# EAGLE schematic IOexpander_2X12_latch  (EAGLE 9.6.2)
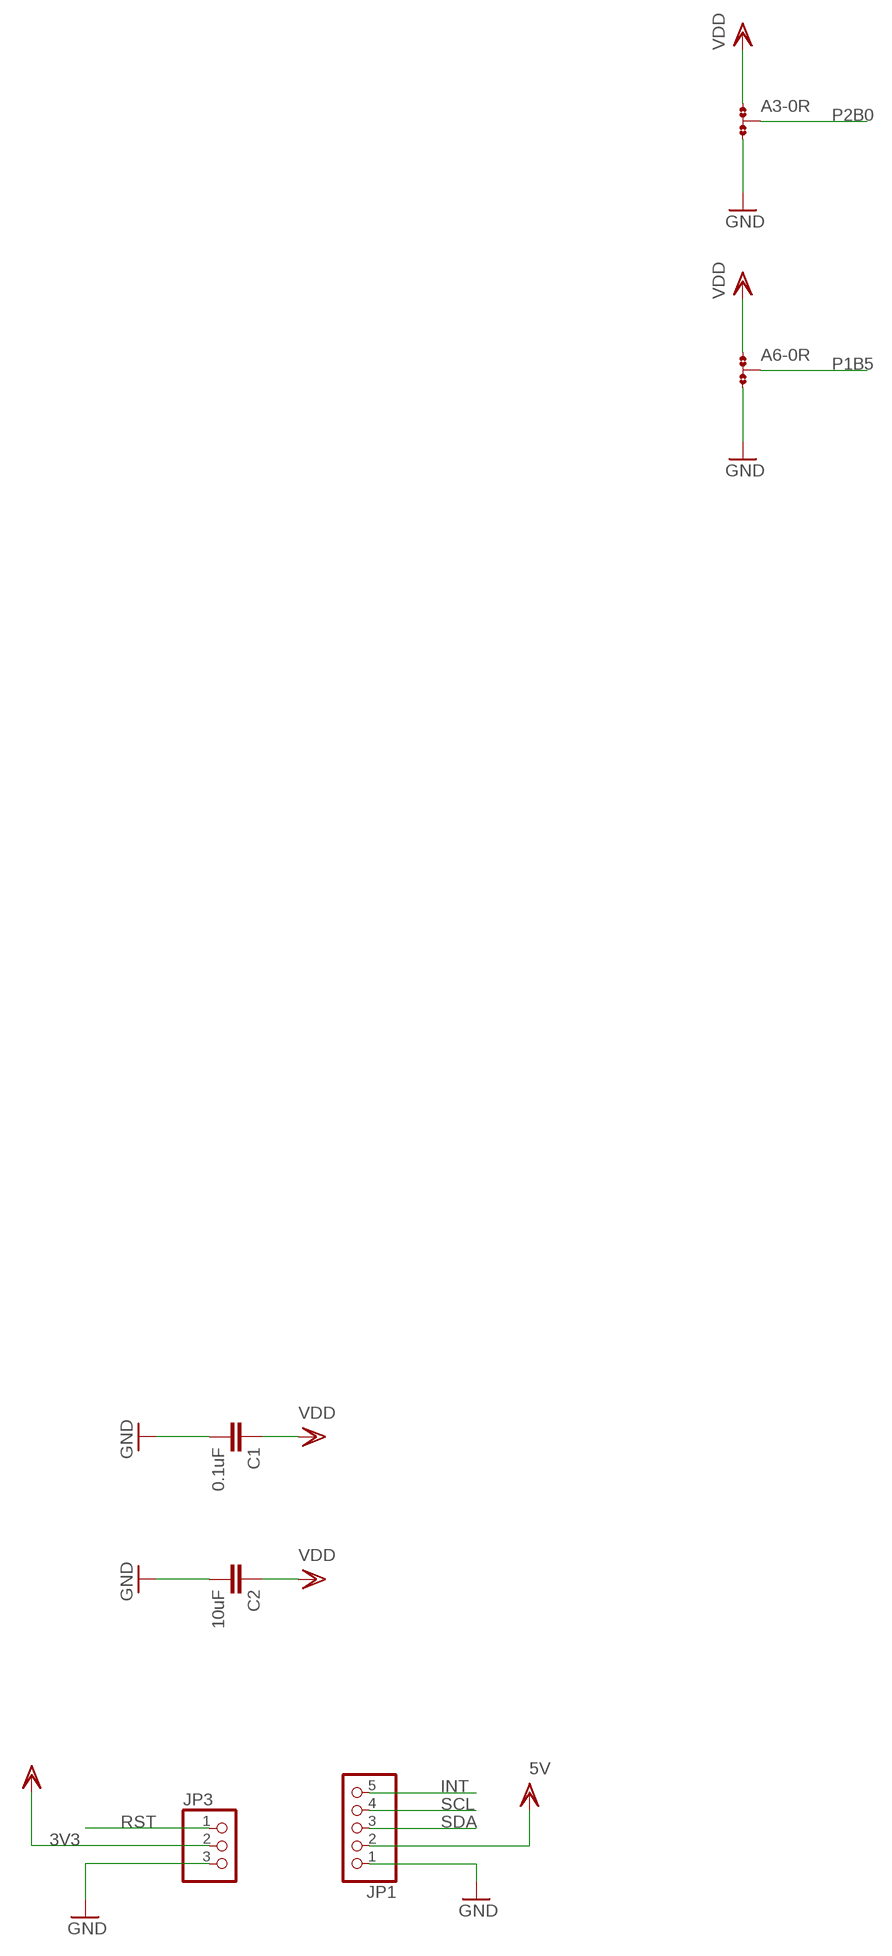
[diagram p0: schematic, sheet 1, part 1 of 2]
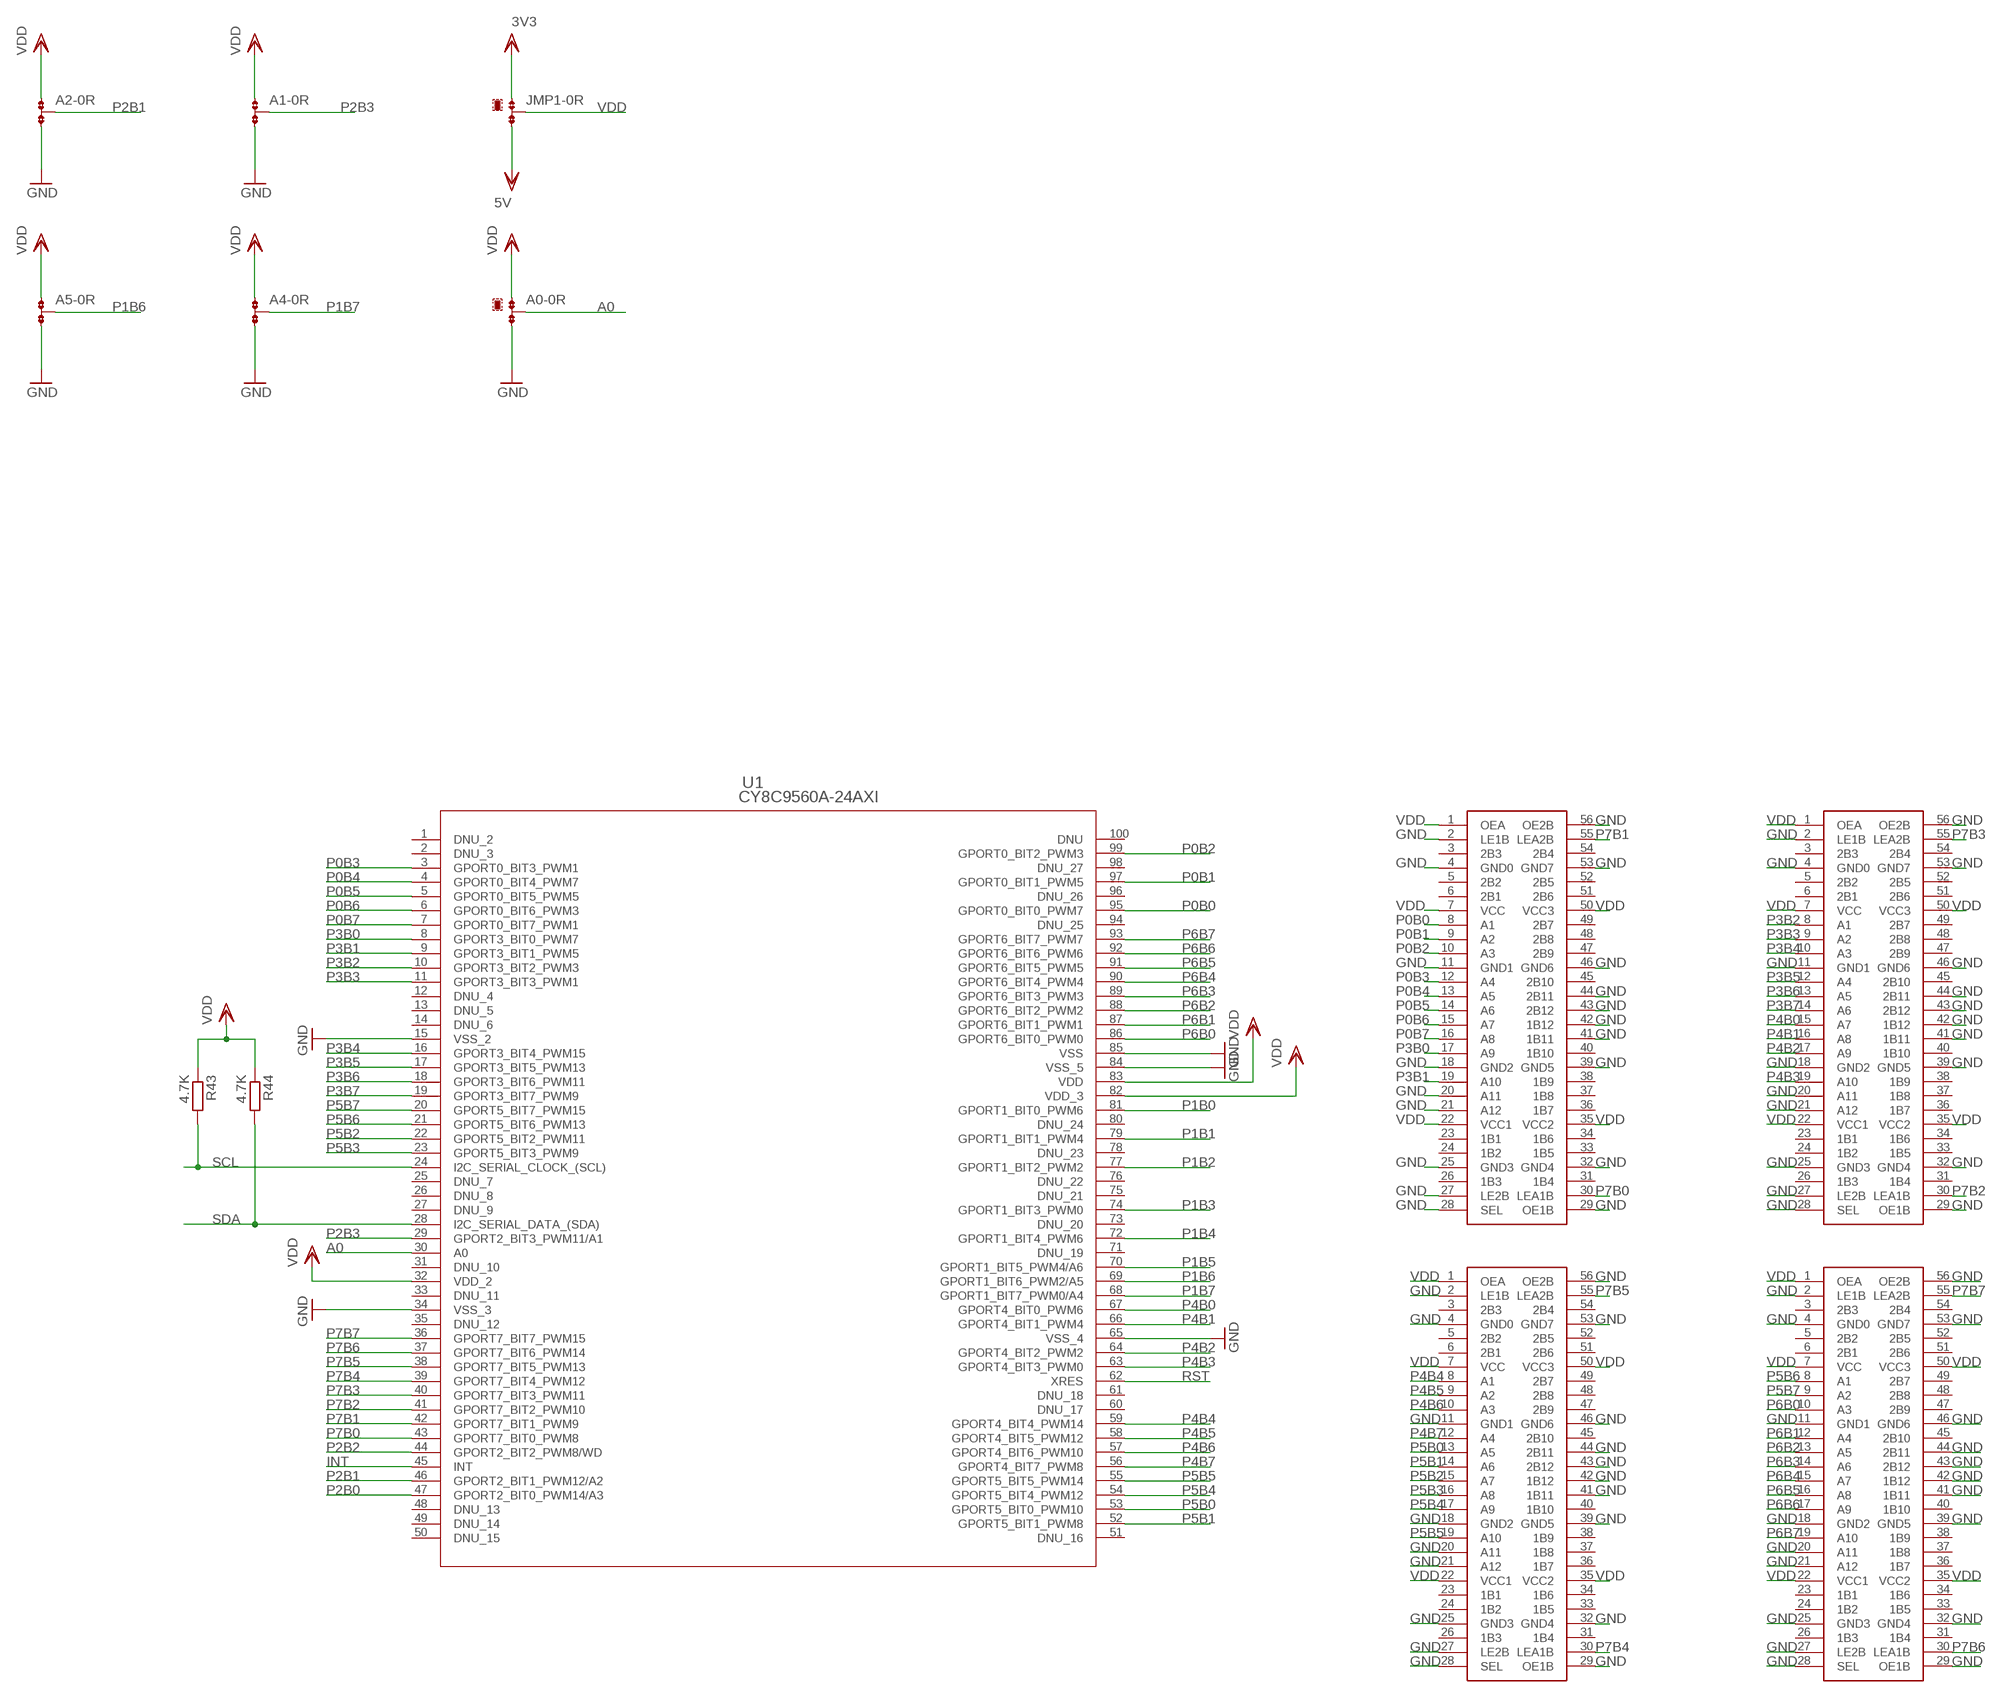
[diagram p1: schematic, sheet 1, part 2 of 2]

## Parts
A0  0R-JUMPA  [A0R-JMP]
A1  0R-JUMPA  [A0R-JMP]
A2  0R-JUMPA  [A0R-JMP]
A3  0R-JUMPA  [A0R-JMP]
A4  0R-JUMPA  [A0R-JMP]
A5  0R-JUMPA  [A0R-JMP]
A6  0R-JUMPA  [A0R-JMP]
C1  0.1uF  C-EUC0805  [C0805]
C2  10uF  C-EUC0805  [C0805]
JMP1  0R-JUMPA  [A0R-JMP]
JP1  PINHD-1X5  [1X05]
JP3  PINHD-1X3  [1X03]
R43  4.7K  R-EU_R0805  [R0805]
R44  4.7K  R-EU_R0805  [R0805]
U1  CY8C9560A-24AXI  [TQFP-100]
U$1  SN74ALVCH162260DLR  [SN74ALVCH162260DLR]
U$2  SN74ALVCH162260DLR  [SN74ALVCH162260DLR]
U$3  SN74ALVCH162260DLR  [SN74ALVCH162260DLR]
U$4  SN74ALVCH162260DLR  [SN74ALVCH162260DLR]

## Nets
3V3: JMP1.1 JP3.2 ; supply symbol labelled VDD
5V: JMP1.3 JP1.2 ; supply symbol labelled VDD
A0: A0.2 U1.30(A0)
GND: A0.3 A1.3 A2.3 A3.3 A4.3 A5.3 A6.3 C1.2 C2.2 JP1.1 JP3.3 U1.15(VSS_2) U1.34(VSS_3) U1.65(VSS_4) U1.84(VSS_5) U1.85(VSS) U$1.2(LE1B) U$1.4(GND0) U$1.11(GND1) U$1.18(GND2) U$1.20(A11) U$1.21(A12) U$1.25(GND3) U$1.27(LE2B) U$1.28(SEL) U$1.29(OE1B) U$1.32(GND4) U$1.39(GND5) U$1.41(1B11) U$1.42(1B12) U$1.43(2B12) U$1.44(2B11) U$1.46(GND6) U$1.53(GND7) U$1.56(OE2B) U$2.2(LE1B) U$2.4(GND0) U$2.11(GND1) U$2.18(GND2) U$2.20(A11) U$2.21(A12) U$2.25(GND3) U$2.27(LE2B) U$2.28(SEL) U$2.29(OE1B) U$2.32(GND4) U$2.39(GND5) U$2.41(1B11) U$2.42(1B12) U$2.43(2B12) U$2.44(2B11) U$2.46(GND6) U$2.53(GND7) U$2.56(OE2B) U$3.2(LE1B) U$3.4(GND0) U$3.11(GND1) U$3.18(GND2) U$3.20(A11) U$3.21(A12) U$3.25(GND3) U$3.27(LE2B) U$3.28(SEL) U$3.29(OE1B) U$3.32(GND4) U$3.39(GND5) U$3.41(1B11) U$3.42(1B12) U$3.43(2B12) U$3.44(2B11) U$3.46(GND6) U$3.53(GND7) U$3.56(OE2B) U$4.2(LE1B) U$4.4(GND0) U$4.11(GND1) U$4.18(GND2) U$4.20(A11) U$4.21(A12) U$4.25(GND3) U$4.27(LE2B) U$4.28(SEL) U$4.29(OE1B) U$4.32(GND4) U$4.39(GND5) U$4.41(1B11) U$4.42(1B12) U$4.43(2B12) U$4.44(2B11) U$4.46(GND6) U$4.53(GND7) U$4.56(OE2B)
INT: JP1.5 U1.45(INT)
P0B0: U1.95(GPORT0_BIT0_PWM7) U$1.8(A1)
P0B1: U1.97(GPORT0_BIT1_PWM5) U$1.9(A2)
P0B2: U1.99(GPORT0_BIT2_PWM3) U$1.10(A3)
P0B3: U1.3(GPORT0_BIT3_PWM1) U$1.12(A4)
P0B4: U1.4(GPORT0_BIT4_PWM7) U$1.13(A5)
P0B5: U1.5(GPORT0_BIT5_PWM5) U$1.14(A6)
P0B6: U1.6(GPORT0_BIT6_PWM3) U$1.15(A7)
P0B7: U1.7(GPORT0_BIT7_PWM1) U$1.16(A8)
P1B0: U1.81(GPORT1_BIT0_PWM6)
P1B1: U1.79(GPORT1_BIT1_PWM4)
P1B2: U1.77(GPORT1_BIT2_PWM2)
P1B3: U1.74(GPORT1_BIT3_PWM0)
P1B4: U1.72(GPORT1_BIT4_PWM6)
P1B5: A6.2 U1.70(GPORT1_BIT5_PWM4/A6)
P1B6: A5.2 U1.69(GPORT1_BIT6_PWM2/A5)
P1B7: A4.2 U1.68(GPORT1_BIT7_PWM0/A4)
P2B0: A3.2 U1.47(GPORT2_BIT0_PWM14/A3)
P2B1: A2.2 U1.46(GPORT2_BIT1_PWM12/A2)
P2B2: U1.44(GPORT2_BIT2_PWM8/WD)
P2B3: A1.2 U1.29(GPORT2_BIT3_PWM11/A1)
P3B0: U1.8(GPORT3_BIT0_PWM7) U$1.17(A9)
P3B1: U1.9(GPORT3_BIT1_PWM5) U$1.19(A10)
P3B2: U1.10(GPORT3_BIT2_PWM3) U$3.8(A1)
P3B3: U1.11(GPORT3_BIT3_PWM1) U$3.9(A2)
P3B4: U1.16(GPORT3_BIT4_PWM15) U$3.10(A3)
P3B5: U1.17(GPORT3_BIT5_PWM13) U$3.12(A4)
P3B6: U1.18(GPORT3_BIT6_PWM11) U$3.13(A5)
P3B7: U1.19(GPORT3_BIT7_PWM9) U$3.14(A6)
P4B0: U1.67(GPORT4_BIT0_PWM6) U$3.15(A7)
P4B1: U1.66(GPORT4_BIT1_PWM4) U$3.16(A8)
P4B2: U1.64(GPORT4_BIT2_PWM2) U$3.17(A9)
P4B3: U1.63(GPORT4_BIT3_PWM0) U$3.19(A10)
P4B4: U1.59(GPORT4_BIT4_PWM14) U$2.8(A1)
P4B5: U1.58(GPORT4_BIT5_PWM12) U$2.9(A2)
P4B6: U1.57(GPORT4_BIT6_PWM10) U$2.10(A3)
P4B7: U1.56(GPORT4_BIT7_PWM8) U$2.12(A4)
P5B0: U1.53(GPORT5_BIT0_PWM10) U$2.13(A5)
P5B1: U1.52(GPORT5_BIT1_PWM8) U$2.14(A6)
P5B2: U1.22(GPORT5_BIT2_PWM11) U$2.15(A7)
P5B3: U1.23(GPORT5_BIT3_PWM9) U$2.16(A8)
P5B4: U1.54(GPORT5_BIT4_PWM12) U$2.17(A9)
P5B5: U1.55(GPORT5_BIT5_PWM14) U$2.19(A10)
P5B6: U1.21(GPORT5_BIT6_PWM13) U$4.8(A1)
P5B7: U1.20(GPORT5_BIT7_PWM15) U$4.9(A2)
P6B0: U1.86(GPORT6_BIT0_PWM0) U$4.10(A3)
P6B1: U1.87(GPORT6_BIT1_PWM1) U$4.12(A4)
P6B2: U1.88(GPORT6_BIT2_PWM2) U$4.13(A5)
P6B3: U1.89(GPORT6_BIT3_PWM3) U$4.14(A6)
P6B4: U1.90(GPORT6_BIT4_PWM4) U$4.15(A7)
P6B5: U1.91(GPORT6_BIT5_PWM5) U$4.16(A8)
P6B6: U1.92(GPORT6_BIT6_PWM6) U$4.17(A9)
P6B7: U1.93(GPORT6_BIT7_PWM7) U$4.19(A10)
P7B0: U1.43(GPORT7_BIT0_PWM8) U$1.30(LEA1B)
P7B1: U1.42(GPORT7_BIT1_PWM9) U$1.55(LEA2B)
P7B2: U1.41(GPORT7_BIT2_PWM10) U$3.30(LEA1B)
P7B3: U1.40(GPORT7_BIT3_PWM11) U$3.55(LEA2B)
P7B4: U1.39(GPORT7_BIT4_PWM12) U$2.30(LEA1B)
P7B5: U1.38(GPORT7_BIT5_PWM13) U$2.55(LEA2B)
P7B6: U1.37(GPORT7_BIT6_PWM14) U$4.30(LEA1B)
P7B7: U1.36(GPORT7_BIT7_PWM15) U$4.55(LEA2B)
RST: JP3.1 U1.62(XRES)
SCL: JP1.4 R43.2 U1.24(I2C_SERIAL_CLOCK_(SCL))
SDA: JP1.3 R44.2 U1.28(I2C_SERIAL_DATA_(SDA))
VDD: A0.1 A1.1 A2.1 A3.1 A4.1 A5.1 A6.1 C1.1 C2.1 JMP1.2 R43.1 R44.1 U1.32(VDD_2) U1.82(VDD_3) U1.83(VDD) U$1.1(OEA) U$1.7(VCC) U$1.22(VCC1) U$1.35(VCC2) U$1.50(VCC3) U$2.1(OEA) U$2.7(VCC) U$2.22(VCC1) U$2.35(VCC2) U$2.50(VCC3) U$3.1(OEA) U$3.7(VCC) U$3.22(VCC1) U$3.35(VCC2) U$3.50(VCC3) U$4.1(OEA) U$4.7(VCC) U$4.22(VCC1) U$4.35(VCC2) U$4.50(VCC3)
Unconnected: U1.1(DNU_2) U1.2(DNU_3) U1.12(DNU_4) U1.13(DNU_5) U1.14(DNU_6) U1.25(DNU_7) U1.26(DNU_8) U1.27(DNU_9) U1.31(DNU_10) U1.33(DNU_11) U1.35(DNU_12) U1.48(DNU_13) U1.49(DNU_14) U1.50(DNU_15) U1.51(DNU_16) U1.60(DNU_17) U1.61(DNU_18) U1.71(DNU_19) U1.73(DNU_20) U1.75(DNU_21) U1.76(DNU_22) U1.78(DNU_23) U1.80(DNU_24) U1.94(DNU_25) U1.96(DNU_26) U1.98(DNU_27) U1.100(DNU) U$1.3(2B3) U$1.5(2B2) U$1.6(2B1) U$1.23(1B1) U$1.24(1B2) U$1.26(1B3) U$1.31(1B4) U$1.33(1B5) U$1.34(1B6) U$1.36(1B7) U$1.37(1B8) U$1.38(1B9) U$1.40(1B10) U$1.45(2B10) U$1.47(2B9) U$1.48(2B8) U$1.49(2B7) U$1.51(2B6) U$1.52(2B5) U$1.54(2B4) U$2.3(2B3) U$2.5(2B2) U$2.6(2B1) U$2.23(1B1) U$2.24(1B2) U$2.26(1B3) U$2.31(1B4) U$2.33(1B5) U$2.34(1B6) U$2.36(1B7) U$2.37(1B8) U$2.38(1B9) U$2.40(1B10) U$2.45(2B10) U$2.47(2B9) U$2.48(2B8) U$2.49(2B7) U$2.51(2B6) U$2.52(2B5) U$2.54(2B4) U$3.3(2B3) U$3.5(2B2) U$3.6(2B1) U$3.23(1B1) U$3.24(1B2) U$3.26(1B3) U$3.31(1B4) U$3.33(1B5) U$3.34(1B6) U$3.36(1B7) U$3.37(1B8) U$3.38(1B9) U$3.40(1B10) U$3.45(2B10) U$3.47(2B9) U$3.48(2B8) U$3.49(2B7) U$3.51(2B6) U$3.52(2B5) U$3.54(2B4) U$4.3(2B3) U$4.5(2B2) U$4.6(2B1) U$4.23(1B1) U$4.24(1B2) U$4.26(1B3) U$4.31(1B4) U$4.33(1B5) U$4.34(1B6) U$4.36(1B7) U$4.37(1B8) U$4.38(1B9) U$4.40(1B10) U$4.45(2B10) U$4.47(2B9) U$4.48(2B8) U$4.49(2B7) U$4.51(2B6) U$4.52(2B5) U$4.54(2B4)

## Library data of the parts
A0 A1-A6 JMP1 = jump-0r-smd:0R-JUMP: SMD 0R 0805 Jumper
C1 C2 = rcl:C-EU: CAPACITOR, European symbol
JP1 = pinhead:PINHD-1X5: PIN HEADER
JP3 = pinhead:PINHD-1X3: PIN HEADER
R43 R44 = rcl:R-EU_: RESISTOR, European symbol
U1 = CY8C9560A-TQFP-100-L:CY8C9560A-24AXI; COPYRIGHT: Copyright (C) 2022 Ultra Librarian. All rights reserved.; MANUFACTURER_PART_NUMBER: CY8C9560A-24AXI; MFR_NAME: Cypress Semiconductor
U$1-U$4 = sn74alvch16260:SN74ALVCH162260DLR